# EAGLE design GoodNightLight (EAGLE 9.6.2)
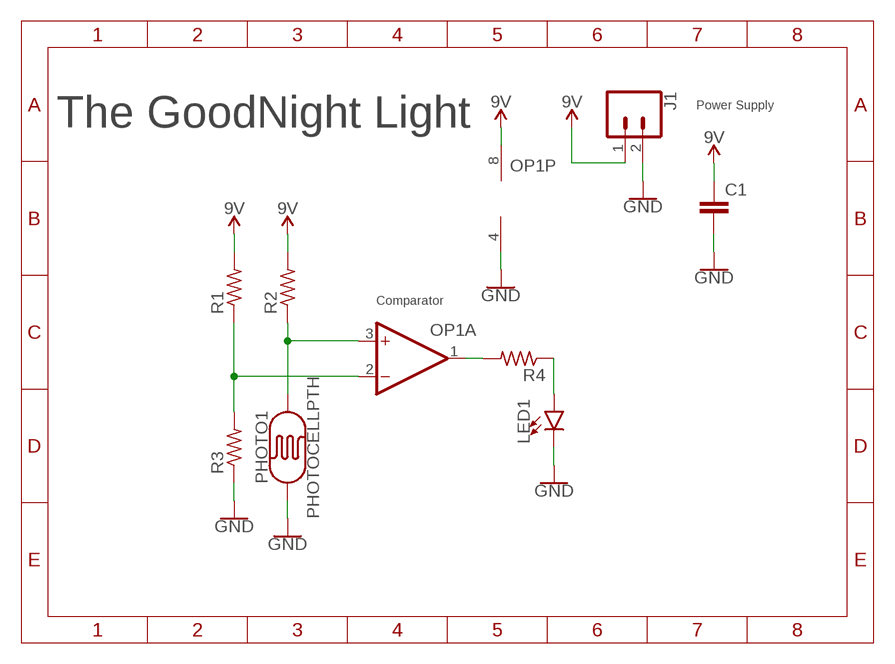
[diagram p0: schematic, sheet 1]

## Parts
C1  CAPACITOR0603  [C0603]
J1  CONN_02  [1X02]
LED1  LED5MM  [LED_5MM]
OP1  OP-DUALR  [SO8]
PHOTO1  PHOTOCELLPTH  [PHOTOCELL]
R1  RESISTOR0603  [R0603]
R2  RESISTOR0603  [R0603]
R3  RESISTOR0603  [R0603]
R4  RESISTOR0603  [R0603]

## Nets
9V: C1.1 J1.1 OP1.8(P:V+) R1.2 R2.2
GND: C1.2 J1.2 LED1.K(C) OP1.4(P:V-) PHOTO1.1 R3.1
N$1: OP1.3(A:+IN) PHOTO1.2 R2.1
N$2: OP1.1(A:OUT) R4.2
N$3: OP1.2(A:-IN) R1.1 R3.2
N$4: LED1.A R4.1
Unconnected: OP1.5(B:+IN) OP1.6(B:-IN) OP1.7(B:OUT)

## Notes on the sheet
- Power Supply
- The GoodNight Light
- Comparator

## Library data of the parts
C1 = LinnesLab-Passives:CAPACITOR
J1 = LinnesLab-Connectors:CONN_02: Multi connection point. Often used as Generic Header-pin footprint for 0.1 inch spaced/style header connections On any of the 0.1 inch spaced packages, you can populate with these: Break Away Headers - Straight <https://www.sparkfun.com/products/116> (PRT-00116) Break Away Male Headers - Right Angle <https://www.sparkfun.com/products/553> (PRT-00553) Female Headers <https://www.sparkfun.com/products/115> (PRT-00115) Break Away Headers - Machine Pin <https://www.sparkfun.com/products/117> (PRT-00117) Break Away Female Headers - Swiss Machine Pin <https://www.sparkfun.com/products/743> (PRT-00743) For SCREWTERMINALS and SPRING TERMINALS visit here: Screw Terimnals on SparkFun.com <https://www.sparkfun.com/search/results?term=Screw+Terminals> (5mm/3.5mm/2.54mm spacing) This device is also useful as a general connection point to wire up your design to another part of your project. Our various solder wires solder well into these plated through hole pads. Hook-Up Wire - Assortment (Stranded, 22 AWG) <https://www.sparkfun.com/products/11375> (PRT-11375) Hook-Up Wire - Assortment (Solid Core, 22 AWG) <https://www.sparkfun.com/products/11367> (PRT-11367) View the entire wire category on our website here <https://www.sparkfun.com/categories/141> Special notes: Molex polarized connector foot print use with: PRT-08233 with associated crimp pins and housings. 2.54_SCREWTERM for use with PRT-10571. 3.5mm Screw Terminal footprints for PRT-08084 5mm Screw Terminal footprints for use with PRT-08432
LED1 = LinnesLab-LED:LED: LED (Generic) Standard schematic elements and footprints for 5mm, 3mm, 1206, and 0603 sized LEDs. Generic LEDs with no color specified. LTST-C190KGKT: arrow indicates cathode
OP1 = LinnesLab-AnalogIC:OP-DUAL: Precision Micropower, Low Noise CMOS, Rail-to-Rail Input/Output Operational Amplifiers Source: http://www.analog.com/static/imported-files/data_sheets/AD8603_8607_8609.pdf; MPN: AD8607ARMZ-R2; OC_FARNELL: 1651293; OC_NEWARK: 19M8927
PHOTO1 = LinnesLab-Sensors:PHOTOCELL: Photocell (Photodetector, Photo Resistor, CdS) This is a very small light sensor. A photocell changes (also called a photodetector, photo resistor, CdS or photoconductive cell) resistance depending on the amount of light it is exposed to. These little sensors make great ambient light triggers (when light in the room turns on, do something). Datasheet <http://cdn.sparkfun.com/datasheets/Sensors/LightImaging/SEN-09088.pdf> SparkFun Products Mini Photocell <https://www.sparkfun.com/products/9088> (SEN-09088); PROD_ID: COMP-09129; SF_ID: SEN-09088
R1-R4 = LinnesLab-Passives:RESISTOR

## Board
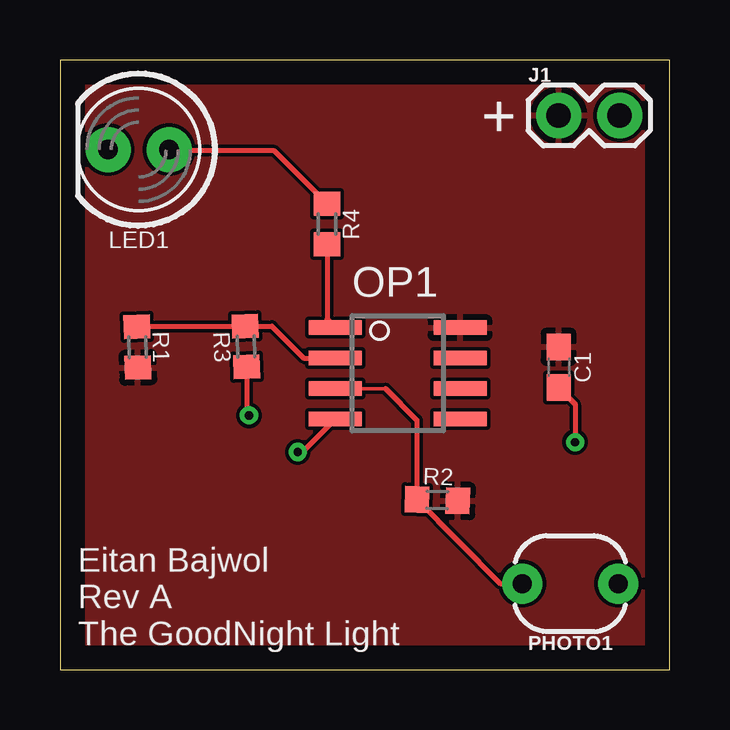
[diagram p1: board, top side]
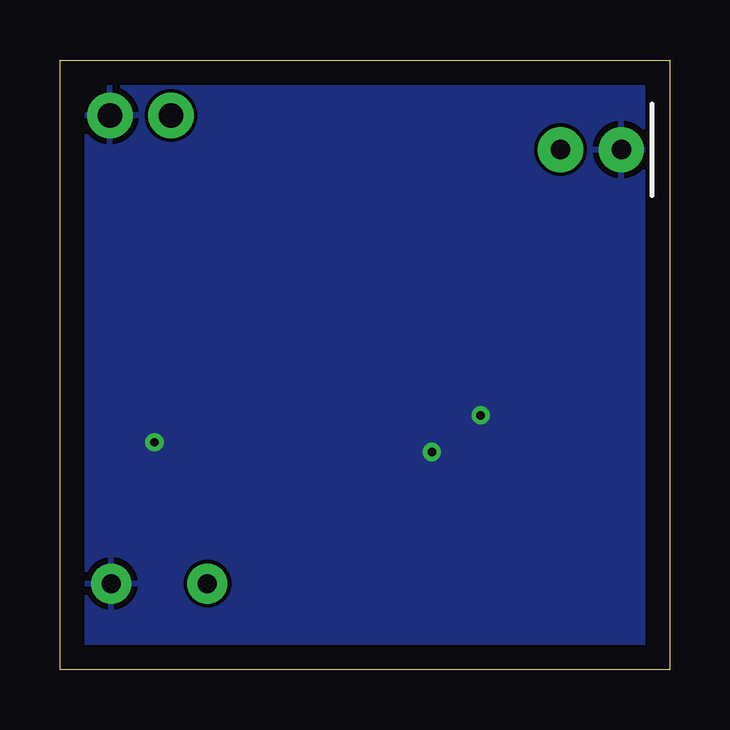
[diagram p2: board, bottom side, seen from below]

Size 25.4 x 25.4 mm. Coordinates in mm from the lower left corner, seen from the top.
Outline: 0,0 25.4,0 25.4,25.4 0,25.4 0,0
Copper layers (1*16): Top 0.035mm / dielectric 1.5mm / Bottom 0.035mm
Design rules "default": minimum track width 6mil, minimum drill 0.35mm, track to track 6mil, track to pad 6mil, pad to pad 6mil, via to via 6mil, smd to smd 6mil, copper to edge 40mil, drill to drill 6mil, minimum pad ring 10mil, minimum via ring 8mil, stop-mask expansion 4mil, vias tented up to drill 0mil, thermal gap 10mil

### Footprints (pad centres in the part's own frame; a part is rotated, then mirrored left to right if it is on the bottom)
C0603 = smd 1.1 x 1: 1 -0.85,0; 2 0.85,0
1X02 = drill 1.016 pad 1.88: 1 0,0; 2 2.54,0
LED_5MM = drill 0.813 pad 1.88: A -1.27,0; K 1.27,0
SO8 = smd 0.6 x 2.2: 1 -1.905,-2.6; 2 -0.635,-2.6; 3 0.635,-2.6; 4 1.905,-2.6; 5 1.905,2.6; 6 0.635,2.6; 7 -0.635,2.6; 8 -1.905,2.6
PHOTOCELL = drill 0.8 pad 1.676: 1 -2,0; 2 2,0
R0603 = smd 1 x 1.1: 1 -0.85,0; 2 0.85,0

### Placement (x,y rotation side)
C1  20.78,12.6 270 top
J1  20.78,23.09 0 top
LED1  3.28,21.67 180 top
OP1  14.07,12.34 270 top
PHOTO1  21.26,3.58 180 top
R1  3.23,13.44 271.4 top
R2  15.72,7.06 358.2 top
R3  7.75,13.46 92.1 top
R4  11.13,18.57 270 top

### Tracks (layer width: path | path; a pad name or v marks a point on that pad's centre or on a via)
9V
  pour Top: 0.05,25.4 25.37,25.4 25.37,0 0.08,0 0,25.35
GND  (via drill 0.35)
  Top 0.203: R3.1 7.78,10.74 7.87,10.64 v7.87,10.59 | OP1.4 10.02,8.99 9.91,8.99 v9.91,9.07 | C1.2 21.46,11.06 v21.46,9.47
  pour Bottom: 25.1,25.1 25.1,0.33 0.38,0.33 0.43,25.04 0.43,25.1
N$1
  Top 0.152: 13.56,11.71 11.96,11.71
  Top 0.203: 11.96,11.71 OP1.3 | PHOTO1.2 18.34,3.58 R2.1 14.87,10.4 13.56,11.71
N$2
  Top 0.203: R4.2 11.12,14.6 OP1.1
N$3
  Top 0.203: R1.1 3.23,14.31 R3.2 8.83,14.31 10.16,12.98 OP1.2
N$4
  Top 0.203: LED1.A 4.6,21.61 8.93,21.61 R4.1

### Text on the board
tPlace: + | Eitan Bajwol / Rev A / The GoodNight Light